# Altium schematic sheet Power.SchDoc
size A4; SheetNumber: 2; SheetTotal: 8
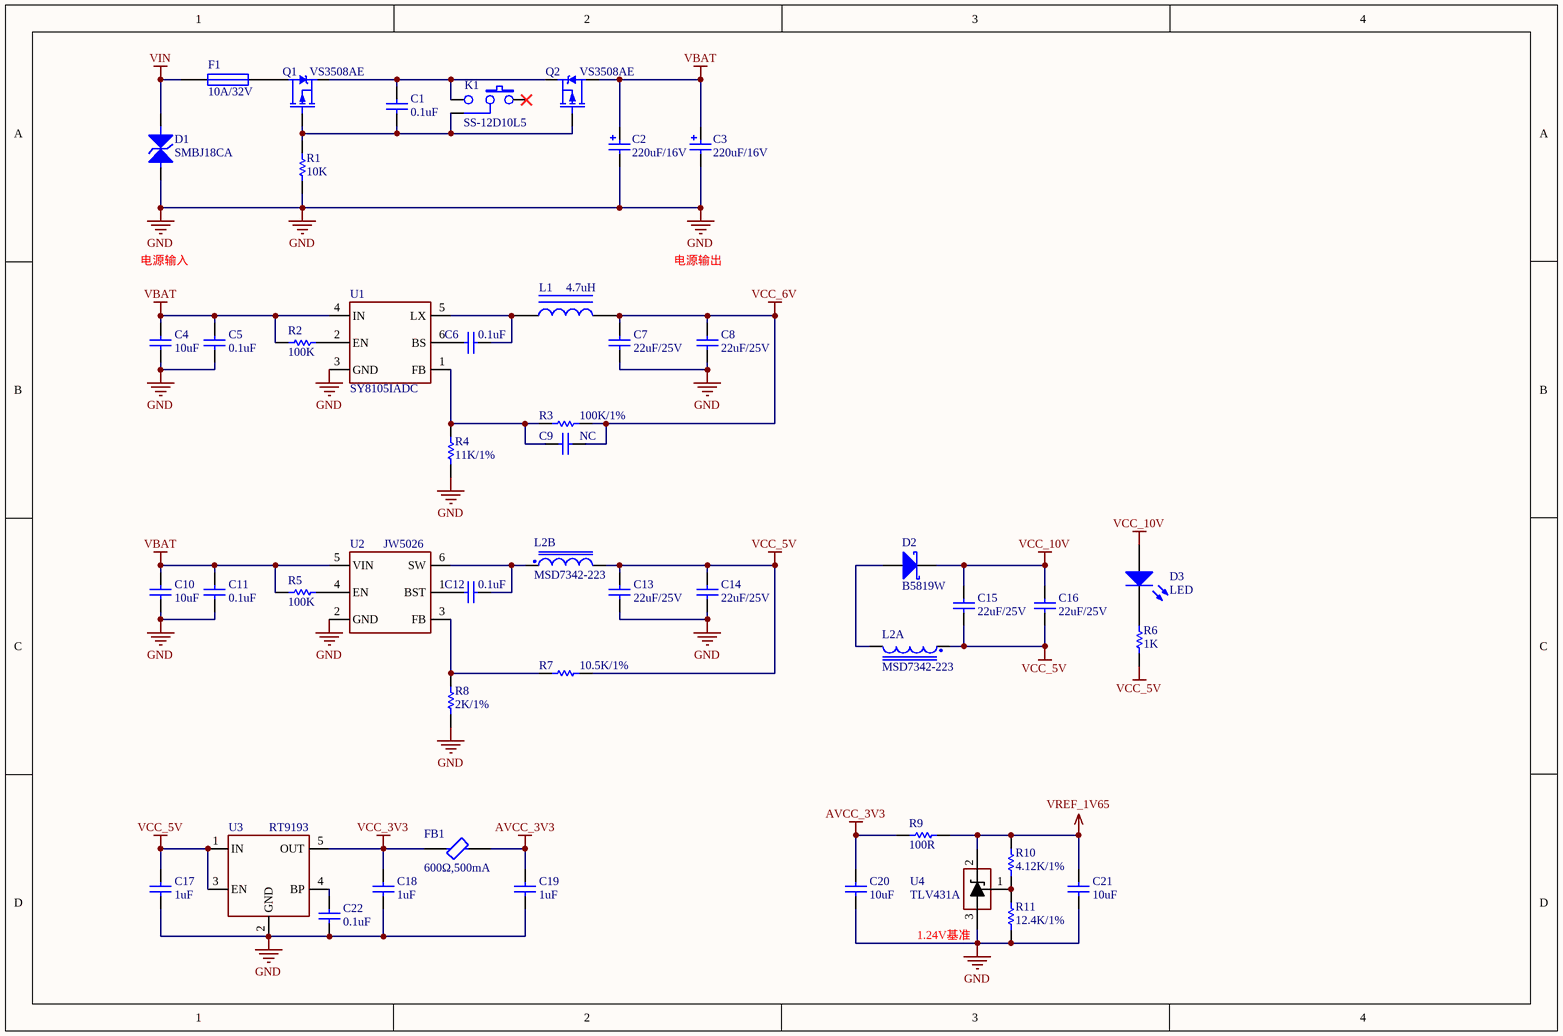
[diagram p0: Power.SchDoc]

## Parts
C1  0.1uF  [C0603_NS]
C2  220uF/16V  [CT 2.5*6.3*7 - R]
C3  220uF/16V  [CT 2.5*6.3*7 - R]
C4  10uF  [C0603_NS]
C5  0.1uF  [C0603_NS]
C6  0.1uF  [C0603_NS]
C7  22uF/25V  [C0805_NS]
C8  22uF/25V  [C0805_NS]
C9  NC  [C0603_NS]
C10  10uF  [C0603_NS]
C11  0.1uF  [C0603_NS]
C12  0.1uF  [C0603_NS]
C13  22uF/25V  [C0805_NS]
C14  22uF/25V  [C0805_NS]
C15  22uF/25V  [C0805_NS]
C16  22uF/25V  [C0805_NS]
C17  1uF  [C0603_NS]
C18  1uF  [C0603_NS]
C19  1uF  [C0603_NS]
C20  10uF  [C0603_NS]
C21  10uF  [C0603_NS]
C22  0.1uF  [C0603_NS]
D1  SMBJ18CA  [SMB]
D2  B5819W  [SOD-123]
D3  LED  [LED0603_NS]
F1  10A/32V  [FU 1206]
FB1  600Ω,500mA  [FB0603_NS]
K1  SS-12D10L5  [SS-12D10]
L1  4.7uH  [L-SMD-0630]
L2  MSD7342-223  [MSD7342]  (parts A,B of 2)
Q1  VS3508AE  [PowerPAK1212-8]
Q2  VS3508AE  [PowerPAK1212-8]
R1  10K  [R0603_NS]
R2  100K  [R0603_NS]
R3  100K/1%  [R0603_NS]
R4  11K/1%  [R0603_NS]
R5  100K  [R0603_NS]
R6  1K  [R0603_NS]
R7  10.5K/1%  [R0603_NS]
R8  2K/1%  [R0603_NS]
R9  100R  [R0603_NS]
R10  4.12K/1%  [R0603_NS]
R11  12.4K/1%  [R0603_NS]
U1  SY8105IADC  [SOT23-6N]
U2  JW5026  [SOT23-6N]
U3  RT9193  [SOT23-5N]
U4  TLV431A  [SOT23-3N]

## Nets
AVCC_3V3: C19.2 C20.2 FB1.2 R9.2
GND: C2.2 C3.2 C4.1 C5.1 C7.1 C8.1 C10.1 C11.1 C13.1 C14.1 C17.1 C18.1 C19.1 C20.1 C21.1 C22.1 D1.A R1.2 R4.2 R8.2 R11.1 U1.3(GND) U2.2(GND) U3.2(GND) U4.3(ANODE)
VBAT: C2.1 C3.1 C4.2 C5.2 C10.2 C11.2 Q2.D R2.2 R5.2 U1.4(IN) U2.5(VIN)
VCC_3V3: C18.2 FB1.1 U3.5(OUT)
VCC_5V: C13.2 C14.2 C15.1 C16.1 C17.2 L2.1 L2.4 R6.2 R7.2 U3.1(IN) U3.3(EN)
VCC_6V: C7.2 C8.2 C9.2 L1.2 R3.2
VCC_10V: C15.2 C16.2 D2.2(K) D3.1(A)
VIN: D1.K F1.1
VREF_1V65: C21.2 R9.1 R10.1 U4.2(CATHODE)
NetC1_1: C1.1 K1.2 Q1.S Q2.S
NetC1_2: C1.2 K1.1 Q1.G Q2.G R1.1
NetC6_1: C6.1 U1.6(BS)
NetC6_2: C6.2 L1.1 U1.5(LX)
NetC9_1: C9.1 R3.1 R4.1 U1.1(FB)
NetC12_1: C12.1 U2.1(BST)
NetC12_2: C12.2 L2.2 U2.6(SW)
NetC22_2: C22.2 U3.4(BP)
NetD2_1: D2.1(A) L2.3
NetD3_2: D3.2(K) R6.1
NetF1_2: F1.2 Q1.D
NetR2_1: R2.1 U1.2(EN)
NetR5_1: R5.1 U2.4(EN)
NetR7_1: R7.1 R8.1 U2.3(FB)
NetR10_2: R10.2 R11.2 U4.1(REF)

Not connected (* = marked no-connect by the designer): K1 3*

## Notes on the sheet
- 电源输入
- 电源输出
- (near U4) 1.24V基准

## Library data of the parts
C1 C4-C22 = Cap: Capacitor
C2 C3 = Cap Pol2: Polarized Capacitor (Axial); Published: 8-Jun-2000; LatestRevisionDate: 17-Jul-2002; LatestRevisionNote: Re-released for DXP Platform.; Publisher: Altium Limited; PackageDescription: Polarized Capacitor; 2 Leads
D1 = TVS: 双向瞬态抑制二极管; pin to pad: A>1 K>2
D2 = D Schottky: Schottky Diode; Published: 8-Jun-2000; LatestRevisionDate: 17-Jul-2002; LatestRevisionNote: Re-released for DXP Platform.; PackageReference: SMB; Publisher: Altium Limited; PackageDescription: DO-214-AA/SMB; 2 C-Bend Leads; Body 5.3 x 3.6 mm, inc. leads (LxW); Code_JEDEC: DO-214-AA
D3 = LED0: Typical INFRARED GaAs LED
F1 = Fuse 1: Fuse; Published: 8-Jun-2000; LatestRevisionDate: 17-Jul-2002; LatestRevisionNote: Re-released for DXP Platform.; PackageReference: PIN-W2/E2.8; Publisher: Altium Limited; PackageDescription: Thru-Hole; 2 Leads
FB1 = Ferrite Bead
K1 = SW2: Right: *; Bottom: *
L1 = Inductor Iron: Magnetic-Core Inductor
L2 = Coupled Inductor
Q1 Q2 = P-MOS: P沟道场效应管
R1-R11 = Res1: Resistor
U1 = SY8105
U4 = TLV431DBZ